# EAGLE design slot_stm32f4 (EAGLE 9.6.2)
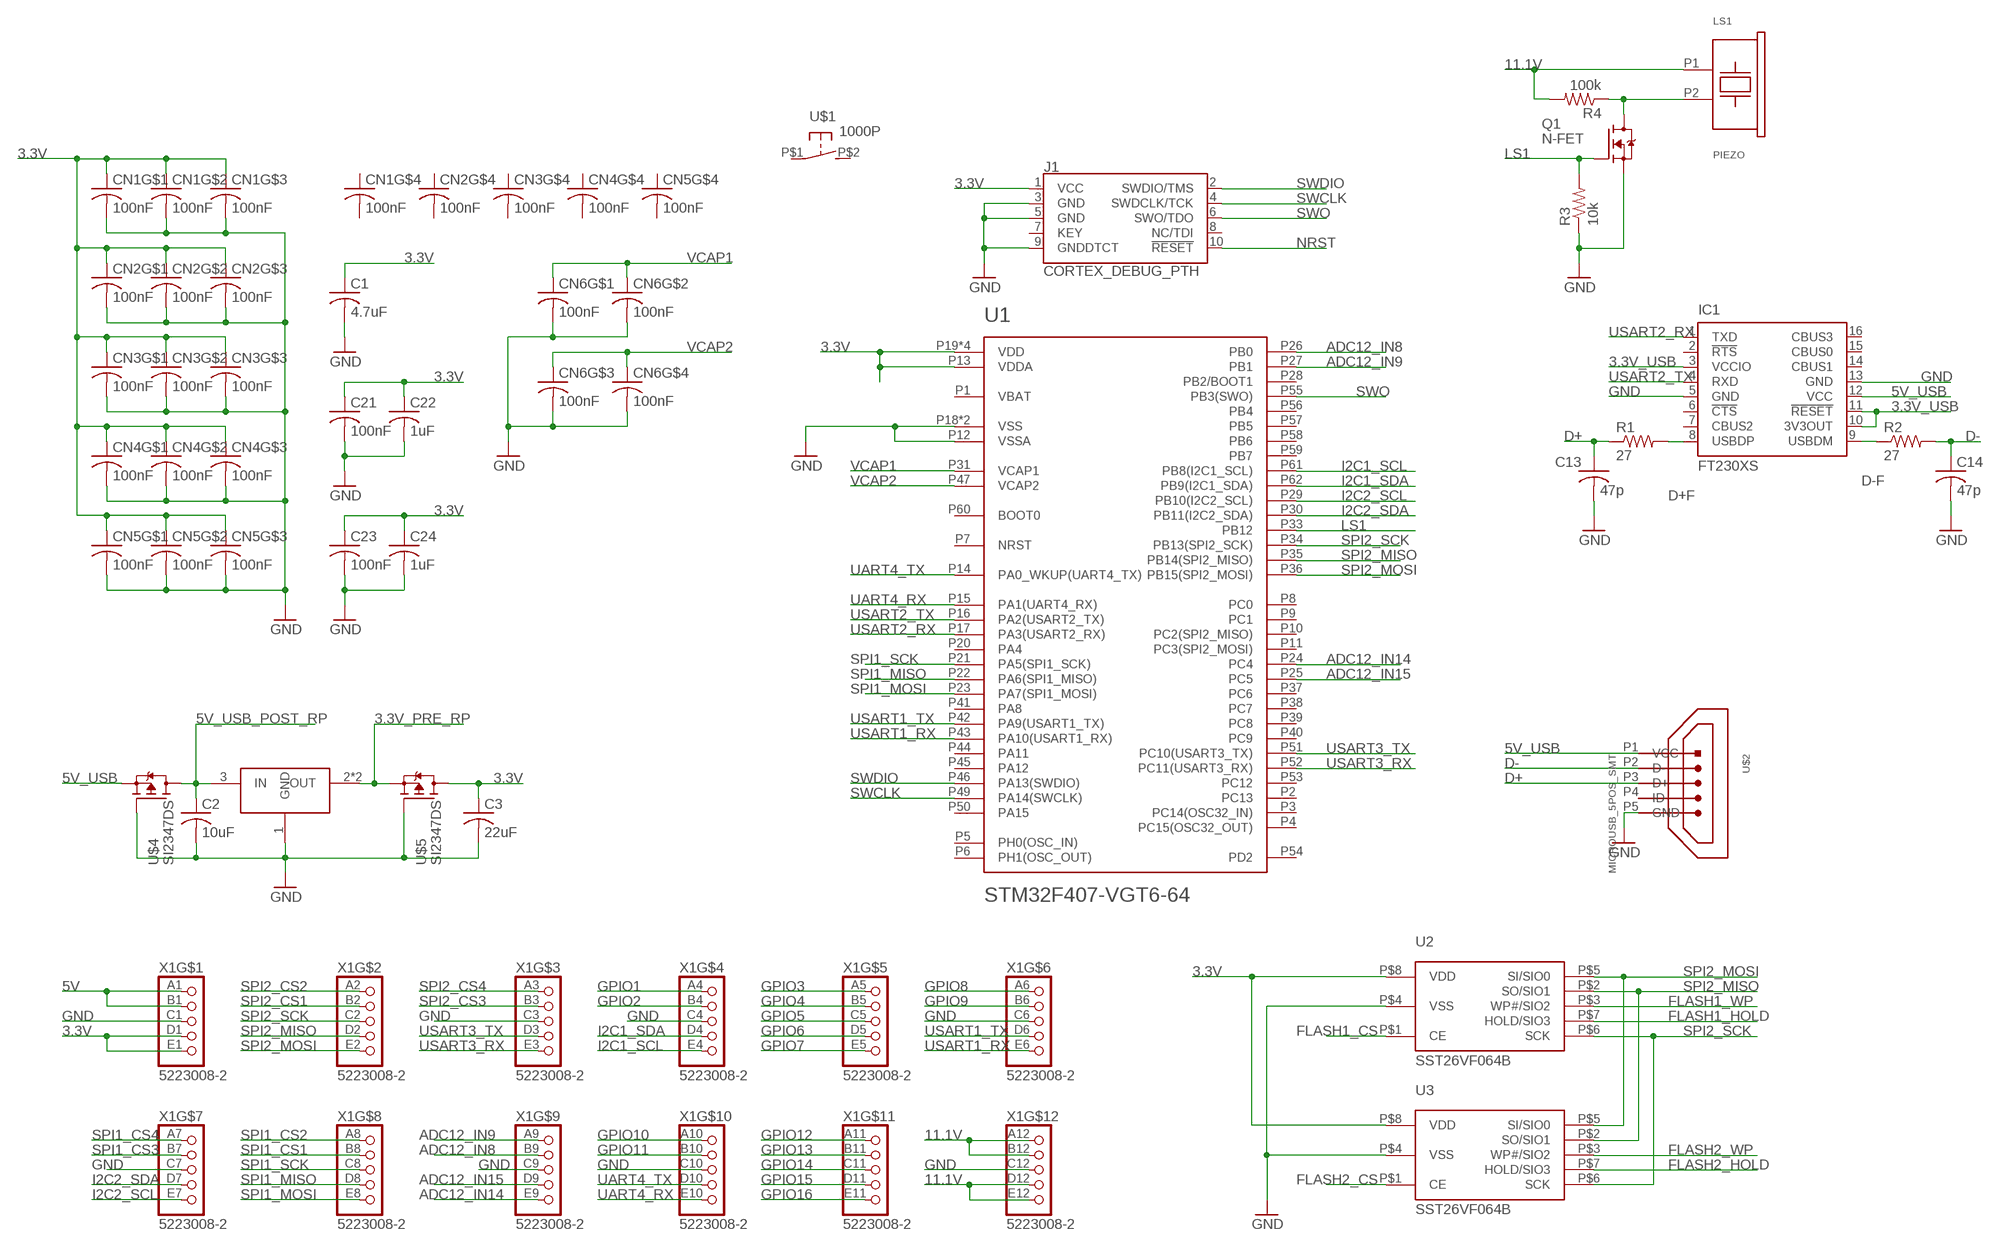
[diagram p0: schematic, sheet 1]

## Parts
C1  4.7uF  C-USC0805  [C0805]
C2  10uF  C-USC0805  [C0805]
C3  22uF  C-USC0805  [C0805]
C13  47p  C-USC0603  [C0603]
C14  47p  C-USC0603  [C0603]
C21  100nF  C-USC0805  [C0805]
C22  1uF  C-USC0805  [C0805]
C23  100nF  C-USC0805  [C0805]
C24  1uF  C-USC0805  [C0805]
CN1  100nF  CA064CXXXXXRAC  [CNET_4POS_0612]
CN2  100nF  CA064CXXXXXRAC  [CNET_4POS_0612]
CN3  100nF  CA064CXXXXXRAC  [CNET_4POS_0612]
CN4  100nF  CA064CXXXXXRAC  [CNET_4POS_0612]
CN5  100nF  CA064CXXXXXRAC  [CNET_4POS_0612]
CN6  100nF  CA064CXXXXXRAC  [CNET_4POS_0612]
IC1  FT230XS  [SSOP16]
J1  CORTEX_DEBUG_PTH  [2X5-PTH-1.27MM]
LS1  PIEZO  [PKMCS0909E400-R1]
Q1  N-FET  [NMINI3-R1-B]
R1  27  R-US_R0603  [R0603]
R2  27  R-US_R0603  [R0603]
R3  10k  R-US_R0603  [R0603]
R4  100k  R-US_R0603  [R0603]
U1  STM32F407-VGT6-64  [LQFP64]
U2  SST26VF064B  [SOIJ]
U3  SST26VF064B  [SOIJ]
U$1  1000P  [B3U-1000P]
U$2  MICROUSB_5POS_SMT  [RECPT_SMT_R/A]
U$3  AZ1117C  [SOT89]
U$4  SI2347DS  [SOT23]
U$5  SI2347DS  [SOT23]
X1  5223008-2  [5223008-2]

## Nets
3.3V: C1.1 C3.1 C21.1 C22.1 C23.1 C24.1 CN1.C1A CN1.C2A CN1.C3A CN2.C1A CN2.C2A CN2.C3A CN3.C1A CN3.C2A CN3.C3A CN4.C1A CN4.C2A CN4.C3A CN5.C1A CN5.C2A CN5.C3A J1.1(VCC) U1.P13(VDDA) U1.P19(VDD) U1.P32(VDD) U1.P48(VDD) U1.P64(VDD) U2.P$8(VDD) U3.P$8(VDD) U$5.3(D) X1.D1 X1.E1
3.3V_PRE_RP: U$3.2(OUT) U$3.2@1(OUT) U$5.2(S)
3.3V_USB: IC1.3(VCCIO) IC1.10(3V3OUT) IC1.11(!RESET)
5V: X1.A1 X1.B1
5V_USB: IC1.12(VCC) U$2.P1(VCC) U$4.2(S)
5V_USB_POST_RP: C2.1 U$3.3(IN) U$4.3(D)
11.1V: LS1.P1 R4.2 X1.A12 X1.B12 X1.D12 X1.E12
ADC12_IN8: U1.P26(PB0) X1.B9
ADC12_IN9: U1.P27(PB1) X1.A9
ADC12_IN14: U1.P24(PC4) X1.E9
ADC12_IN15: U1.P25(PC5) X1.D9
D+: C13.1 R1.1 U$2.P3(D+)
D+F: IC1.8(USBDP) R1.2
D-: C14.1 R2.2 U$2.P2(D-)
D-F: IC1.9(USBDM) R2.1
FLASH1_CS: U2.P$1(CE)
FLASH1_HOLD: U2.P$7(HOLD/SIO3)
FLASH1_WP: U2.P$3(WP#/SIO2)
FLASH2_CS: U3.P$1(CE)
FLASH2_HOLD: U3.P$7(HOLD/SIO3)
FLASH2_WP: U3.P$3(WP#/SIO2)
GND: C1.2 C2.2 C3.2 C13.2 C14.2 C21.2 C22.2 C23.2 C24.2 CN1.C1B CN1.C2B CN1.C3B CN2.C1B CN2.C2B CN2.C3B CN3.C1B CN3.C2B CN3.C3B CN4.C1B CN4.C2B CN4.C3B CN5.C1B CN5.C2B CN5.C3B CN6.C1B CN6.C2B CN6.C3B CN6.C4B IC1.5(GND) IC1.13(GND) J1.3(GND) J1.5(GND) J1.9(GNDDTCT) Q1.3(S) R3.1 U1.P12(VSSA) U1.P18(VSS) U1.P63(VSS) U2.P$4(VSS) U3.P$4(VSS) U$2.P5(GND) U$3.1(GND) U$4.1(G) U$5.1(G) X1.C1 X1.C3 X1.C4 X1.C6 X1.C7 X1.C9 X1.C10 X1.C12
GPIO1: X1.A4
GPIO2: X1.B4
GPIO3: X1.A5
GPIO4: X1.B5
GPIO5: X1.C5
GPIO6: X1.D5
GPIO7: X1.E5
GPIO8: X1.A6
GPIO9: X1.B6
GPIO10: X1.A10
GPIO11: X1.B10
GPIO12: X1.A11
GPIO13: X1.B11
GPIO14: X1.C11
GPIO15: X1.D11
GPIO16: X1.E11
I2C1_SCL: U1.P61(PB8(I2C1_SCL)) X1.E4
I2C1_SDA: U1.P62(PB9(I2C1_SDA)) X1.D4
I2C2_SCL: U1.P29(PB10(I2C2_SCL)) X1.E7
I2C2_SDA: U1.P30(PB11(I2C2_SDA)) X1.D7
LS1: Q1.2(G) R3.2 U1.P33(PB12)
N$2: LS1.P2 Q1.1(D) R4.1
NRST: J1.10(!RESET)
SPI1_CS1: X1.B8
SPI1_CS2: X1.A8
SPI1_CS3: X1.B7
SPI1_CS4: X1.A7
SPI1_MISO: U1.P22(PA6(SPI1_MISO)) X1.D8
SPI1_MOSI: U1.P23(PA7(SPI1_MOSI)) X1.E8
SPI1_SCK: U1.P21(PA5(SPI1_SCK)) X1.C8
SPI2_CS1: X1.B2
SPI2_CS2: X1.A2
SPI2_CS3: X1.B3
SPI2_CS4: X1.A3
SPI2_MISO: U1.P35(PB14(SPI2_MISO)) U2.P$2(SO/SIO1) U3.P$2(SO/SIO1) X1.D2
SPI2_MOSI: U1.P36(PB15(SPI2_MOSI)) U2.P$5(SI/SIO0) U3.P$5(SI/SIO0) X1.E2
SPI2_SCK: U1.P34(PB13(SPI2_SCK)) U2.P$6(SCK) U3.P$6(SCK) X1.C2
SWCLK: J1.4(SWDCLK/TCK) U1.P49(PA14(SWCLK))
SWDIO: J1.2(SWDIO/TMS) U1.P46(PA13(SWDIO))
SWO: J1.6(SWO/TDO) U1.P55(PB3(SWO))
UART4_RX: U1.P15(PA1(UART4_RX)) X1.E10
UART4_TX: U1.P14(PA0_WKUP(UART4_TX)) X1.D10
USART1_RX: U1.P43(PA10(USART1_RX)) X1.E6
USART1_TX: U1.P42(PA9(USART1_TX)) X1.D6
USART2_RX: IC1.1(TXD) U1.P17(PA3(USART2_RX))
USART2_TX: IC1.4(RXD) U1.P16(PA2(USART2_TX))
USART3_RX: U1.P52(PC11(USART3_RX)) X1.E3
USART3_TX: U1.P51(PC10(USART3_TX)) X1.D3
VCAP1: CN6.C1A CN6.C2A U1.P31(VCAP1)
VCAP2: CN6.C3A CN6.C4A U1.P47(VCAP2)
Unconnected: CN1.C4A CN1.C4B CN2.C4A CN2.C4B CN3.C4A CN3.C4B CN4.C4A CN4.C4B CN5.C4A CN5.C4B IC1.2(!RTS) IC1.6(!CTS) IC1.7(CBUS2) IC1.14(CBUS1) IC1.15(CBUS0) IC1.16(CBUS3) J1.7(KEY) J1.8(NC/TDI) U1.P1(VBAT) U1.P2(PC13) U1.P3(PC14(OSC32_IN)) U1.P4(PC15(OSC32_OUT)) U1.P5(PH0(OSC_IN)) U1.P6(PH1(OSC_OUT)) U1.P7(NRST) U1.P8(PC0) U1.P9(PC1) U1.P10(PC2(SPI2_MISO)) U1.P11(PC3(SPI2_MOSI)) U1.P20(PA4) U1.P28(PB2/BOOT1) U1.P37(PC6) U1.P38(PC7) U1.P39(PC8) U1.P40(PC9) U1.P41(PA8) U1.P44(PA11) U1.P45(PA12) U1.P50(PA15) U1.P53(PC12) U1.P54(PD2) U1.P56(PB4) U1.P57(PB5) U1.P58(PB6) U1.P59(PB7) U1.P60(BOOT0) U$1.P$1(P) U$1.P$2(S) U$2.P4(ID)

## Library data of the parts
C1-C3 C21-C24 = rcl:C-US: CAPACITOR, American symbol; SPICEPREFIX: C
C13 C14 = resistor:C-US: CAPACITOR, American symbol
CN1-CN6 = CPSS_MISC:CA064CXXXXXRAC
IC1 = ftdichip:FT230X: USB to BASIC UART IC Auto generated by make-symbol-device-package-bsdl.ulp Rev. 43 Source: Data sheet <http://www.ftdichip.com/Support/Documents/DataSheets/ICs/DS_FT230X.pdf>
J1 = SparkFun-Connectors:CORTEX_DEBUG: Cortex Debug Connector - 10 pin Supports JTAG debug, Serial Wire debug, and Serial Wire Viewer. PTH and SMD connector options available. General Connector Information <http://infocenter.arm.com/help/topic/com.arm.doc.faqs/attached/13634/cortex_debug_connectors.pdf> Products: PTH Connector <http://www.digikey.com/product-detail/en/cnc-tech/3220-10-0100-00/1175-1627-ND/3883661> -via Digi-Key SparkFun PSoc <https://www.sparkfun.com/products/13229> SparkFun T <https://www.sparkfun.com/products/13810>
LS1 = CPSS_MISC:PIEZO
Q1 = CPSS_MISC:N-FET
R1-R4 = resistor:R-US_: RESISTOR, American symbol
U1 = CPSS_CPU:STM32F407-VGT6-64
U2 U3 = CPSS_IC:SST26VF064B
U$1 = CPSS_MISC:1000P
U$2 = CPSS_CONNECTOR:MICROUSB_5POS_SMT
U$3 = CPSS_IC:AZ1117C
U$4 U$5 = CPSS_IC:SI2347DS
X1 = backplane:5223008-2

## Board
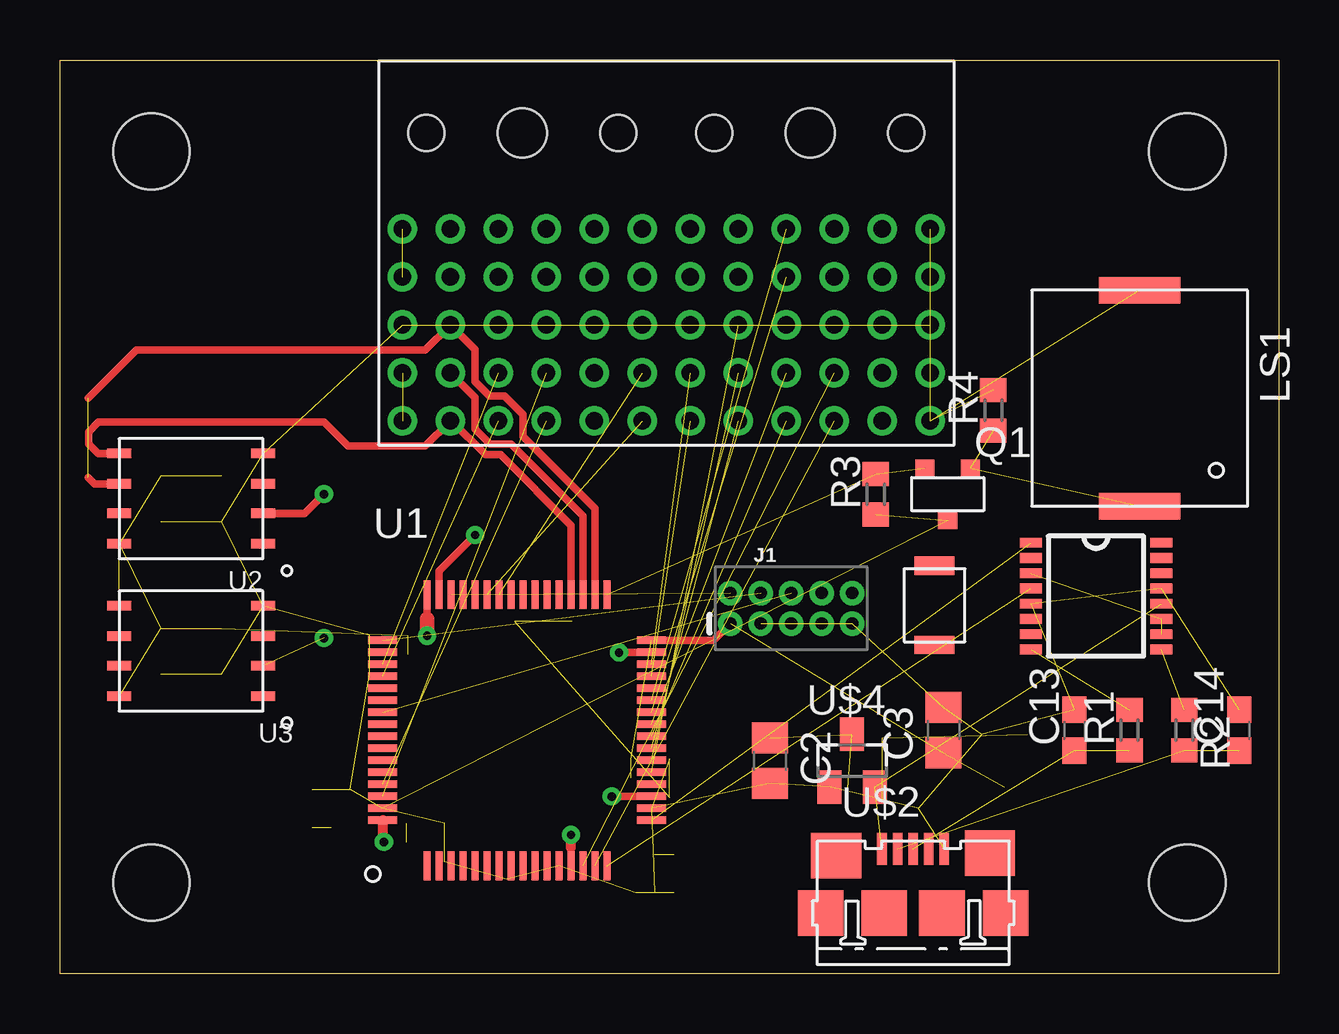
[diagram p1: board, top side]
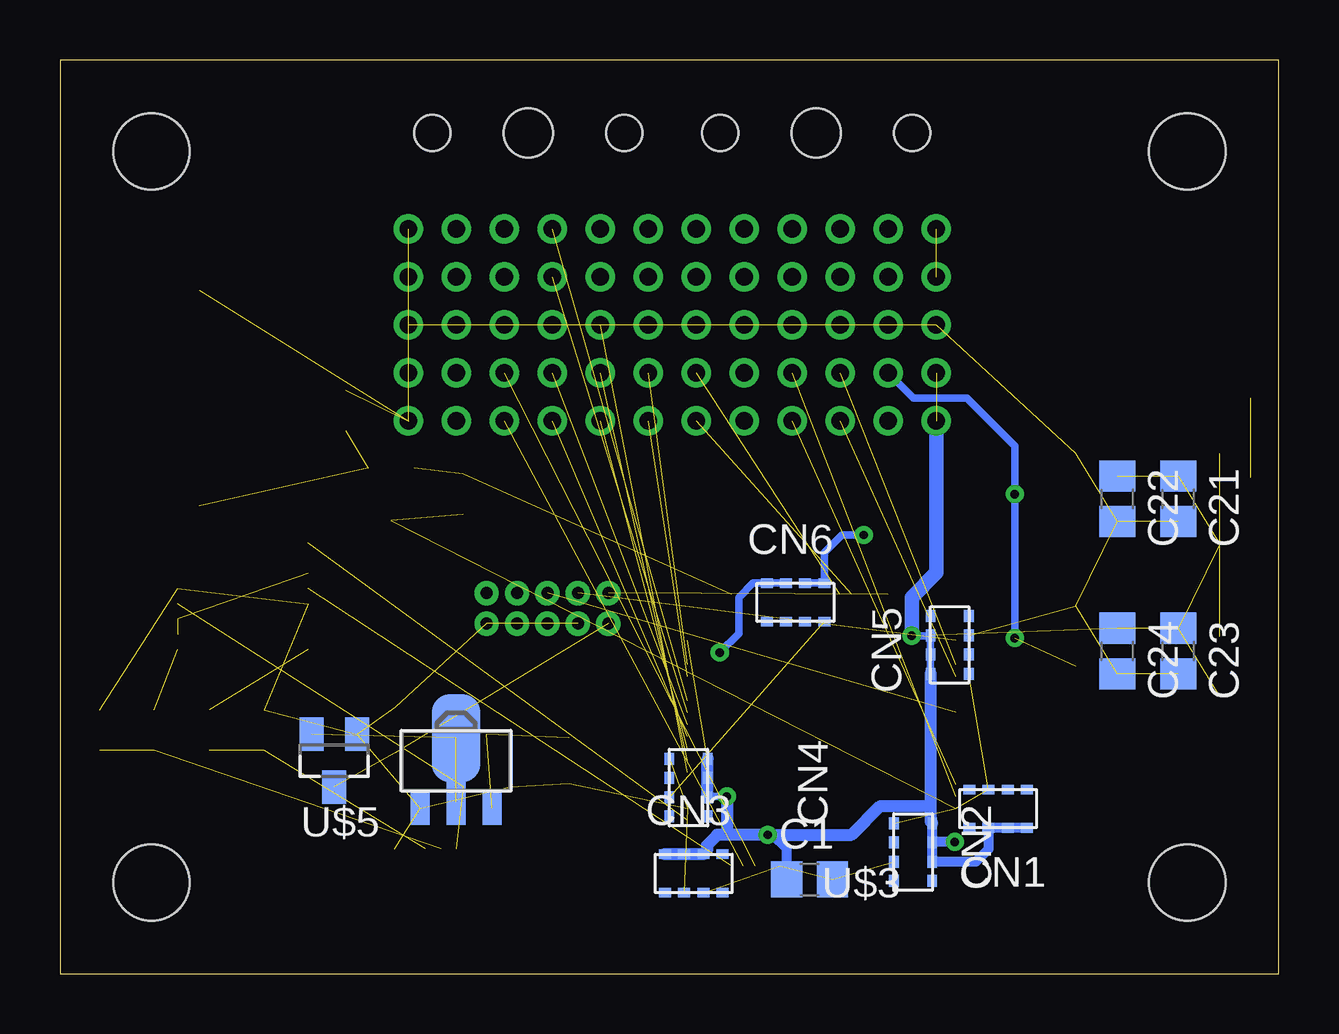
[diagram p2: board, bottom side, seen from below]

Size 50.8 x 38.1 mm. Coordinates in mm from the lower left corner, seen from the top.
Outline: 0,0 0,38.1 50.8,38.1 50.8,0 0,0
Copper layers (1*16): Top 0.035mm / dielectric 1.5mm / Bottom 0.035mm
Design rules "default": minimum track width 6mil, minimum drill 0.35mm, track to track 6mil, track to pad 6mil, pad to pad 6mil, via to via 6mil, smd to smd 6mil, copper to edge 40mil, drill to drill 6mil, minimum pad ring 10mil, minimum via ring 8mil, stop-mask expansion 4mil, vias tented up to drill 0mil, thermal gap 10mil
Holes 3.17 mm at 3.81,3.81 46.99,3.81 46.99,34.29 3.81,34.29
tRestrict: area 0,30.5 to 7.6,38.1; area 43.2,30.5 to 50.8,38.1; area 43.2,0 to 50.8,7.6; area 0,0 to 7.6,7.6

### Footprints (pad centres in the part's own frame; a part is rotated, then mirrored left to right if it is on the bottom)
C0805 = smd 1.3 x 1.5: 1 -0.95,0; 2 0.95,0
C0603 = smd 1.1 x 1: 1 -0.85,0; 2 0.85,0
CNET_4POS_0612 = smd 0.5 x 0.4: C1A -1.2,0.8; C1B -1.2,-0.8; C2A -0.4,0.8; C2B -0.4,-0.8; C3A 0.4,0.8; C3B 0.4,-0.8; C4A 1.2,0.8; C4B 1.2,-0.8
SSOP16 = smd 0.914 x 0.406: 1 -2.718,2.223; 2 -2.718,1.587; 3 -2.718,0.953; 4 -2.718,0.318; 5 -2.718,-0.318; 6 -2.718,-0.953; 7 -2.718,-1.587; 8 -2.718,-2.223; 9 2.718,-2.223; 10 2.718,-1.587; 11 2.718,-0.953; 12 2.718,-0.318; 13 2.718,0.318; 14 2.718,0.953; 15 2.718,1.587; 16 2.718,2.223
2X5-PTH-1.27MM = drill 0.508 pad 1: 1 -2.54,-0.635; 2 -2.54,0.635; 3 -1.27,-0.635; 4 -1.27,0.635; 5 0,-0.635; 6 0,0.635; 7 1.27,-0.635; 8 1.27,0.635; 9 2.54,-0.635; 10 2.54,0.635
PKMCS0909E400-R1 = smd 1.1 x 3.4: P1 -4.5,0; P2 4.5,0
NMINI3-R1-B = smd 0.8 x 0.7: 1 -0.95,-1.1; 2 0.95,-1.1; 3 0,1.1
R0603 = smd 1 x 1.1: 1 -0.85,0; 2 0.85,0
LQFP64 = smd 0.3 x 1.2: P1 -3.75,-5.65; P2 -3.25,-5.65; P3 -2.75,-5.65; P4 -2.25,-5.65; P5 -1.75,-5.65; P6 -1.25,-5.65; P7 -0.75,-5.65; P8 -0.25,-5.65; P9 0.25,-5.65; P10 0.75,-5.65; P11 1.25,-5.65; P12 1.75,-5.65; P13 2.25,-5.65; P14 2.75,-5.65; P15 3.25,-5.65; P16 3.75,-5.65; P33 3.75,5.65; P34 3.25,5.65; P35 2.75,5.65; P36 2.25,5.65; P37 1.75,5.65; P38 1.25,5.65; P39 0.75,5.65; P40 0.25,5.65; P41 -0.25,5.65; P42 -0.75,5.65; P43 -1.25,5.65; P44 -1.75,5.65; P45 -2.25,5.65; P46 -2.75,5.65; P47 -3.25,5.65; P48 -3.75,5.65 | smd 1.2 x 0.3: P17 5.6,-3.75; P18 5.6,-3.25; P19 5.6,-2.75; P20 5.6,-2.25; P21 5.6,-1.75; P22 5.6,-1.25; P23 5.6,-0.75; P24 5.6,-0.25; P25 5.6,0.25; P26 5.6,0.75; P27 5.6,1.25; P28 5.6,1.75; P29 5.6,2.25; P30 5.6,2.75; P31 5.6,3.25; P32 5.6,3.75; P49 -5.6,3.75; P50 -5.6,3.25; P51 -5.6,2.75; P52 -5.6,2.25; P53 -5.6,1.75; P54 -5.6,1.25; P55 -5.6,0.75; P56 -5.6,0.25; P57 -5.6,-0.25; P58 -5.6,-0.75; P59 -5.6,-1.25; P60 -5.6,-1.75; P61 -5.6,-2.25; P62 -5.6,-2.75; P63 -5.6,-3.25; P64 -5.6,-3.75
SOIJ = smd 1 x 0.4: P$1 -3,1.885; P$2 -3,0.614; P$3 -3,-0.614; P$4 -3,-1.885; P$5 3,-1.885; P$6 3,-0.614; P$7 3,0.614; P$8 3,1.885
B3U-1000P = smd 1.651 x 0.762: P$1 0,-1.651; P$2 0,1.651
RECPT_SMT_R/A = smd 2.1 x 1.9: ATT1 -3.2,2.4; ATT2 3.2,2.5 | smd 1.9 x 1.9: ATT3 -3.85,0; ATT4 -1.2,0; ATT5 1.2,0; ATT6 3.85,0 | smd 0.4 x 1.35: P1 -1.3,2.675; P2 -0.65,2.675; P3 0,2.675; P4 0.65,2.675; P5 1.3,2.675
SOT89 = smd 0.8 x 1.4: 1 -1.499,-1.981; 3 1.499,-1.981 | smd 0.8 x 1.9: 2 0,-1.727 | smd 2.032 x 3.65: 2@1 0,0.94
SOT23 = smd 1 x 1.4: 1 -0.95,-1.1; 2 0.95,-1.1; 3 0,1.1
5223008-2 = drill 0.725: A1 -11,4; A2 -9,4; A3 -7,4; A4 -5,4; A5 -3,4; A6 -1,4; A7 1,4; A8 3,4; A9 5,4; A10 7,4; A11 9,4; A12 11,4; B1 -11,2; B2 -9,2; B3 -7,2; B4 -5,2; B5 -3,2; B6 -1,2; B7 1,2; B8 3,2; B9 5,2; B10 7,2; B11 9,2; B12 11,2; C1 -11,0; C2 -9,0; C3 -7,0; C4 -5,0; C5 -3,0; C6 -1,0; C7 1,0; C8 3,0; C9 5,0; C10 7,0; C11 9,0; C12 11,0; D1 -11,-2; D2 -9,-2; D3 -7,-2; D4 -5,-2; D5 -3,-2; D6 -1,-2; D7 1,-2; D8 3,-2; D9 5,-2; D10 7,-2; D11 9,-2; D12 11,-2; E1 -11,-4; E2 -9,-4; E3 -7,-4; E4 -5,-4; E5 -3,-4; E6 -1,-4; E7 1,-4; E8 3,-4; E9 5,-4; E10 7,-4; E11 9,-4; E12 11,-4 | hole 2.05: -6,8; 6,8 | hole 1.5: -10,8; -2,8; 10,8; 2,8

### Placement (x,y rotation side)
C1  19.56,3.94 0 bottom
C2  29.59,8.89 270 top
C3  36.83,10.16 90 top
C13  42.29,10.16 90 top
C14  49.15,10.16 90 top
C21  4.19,19.81 270 bottom
C22  6.73,19.81 270 bottom
C23  4.19,13.46 270 bottom
C24  6.73,13.46 270 bottom
CN1  11.7,6.89 180 bottom
CN2  15.24,5.08 270 bottom
CN3  24.38,4.19 0 bottom
CN4  24.6,7.77 270 bottom
CN5  13.72,13.72 90 bottom
CN6  20.14,15.49 0 bottom
IC1  43.18,15.75 0 top
J1  30.48,15.24 0 top
LS1  45,24 270 top
Q1  37,20 180 top
R1  44.58,10.16 90 top
R2  46.86,10.16 270 top
R3  34,20 90 top
R4  38.9,23.5 90 top
U1  19.05,10.16 0 top
U2  5.46,19.81 180 top
U3  5.46,13.46 180 top
U$1  36.45,15.37 0 top
U$2  35.56,2.54 0 top
U$3  34.29,8.89 0 bottom
U$4  33.02,8.89 0 top
U$5  39.37,8.89 180 bottom
X1  25.27,27.05 0 top

### Tracks (layer width: path | path; a pad name or v marks a point on that pad's centre or on a via)
3.3V  (via drill 0.35)  (15 unrouted)
  Top 0.305: U1.P13 21.3,5.26 | 15.3,14.8 U1.P48 | U1.P19 v23.01,7.41 v23,7.4 | U1.P32 27.25,13.91 J1.1
  Top 0.406: U1.P64 13.45,5.55 v13.5,5.5 | 21.3,5.26 v21.3,5.8
  Top 0.61: v15.3,14.1 15.3,14.8
  Bottom 0.305: CN5.C1A CN5.C3A 14.53,14.1 v15.3,14.1 | v23,7.4 23.77,7.4 CN4.C3A
  Bottom 0.406: CN1.C1A CN1.C3A 12.1,5.2 12.62,4.68 CN2.C3A 14.44,5.5 | 14.44,5.5 CN2.C1A | v13.5,5.5 14.44,5.5 | C1.1 20.51,5.21 21.1,5.8 v21.3,5.8
  Bottom 0.508: CN5.C1A 14.52,7 | 14.52,7 14.52,6.36 CN2.C1A | 14.52,7 16.6,7 17.8,5.8 v21.3,5.8 23,5.8 | 23,5.8 23.4,5.8 23.84,5.36 23.84,5.13 CN3.C3A CN3.C1A | CN4.C3A CN4.C1A | v23,7.4 23,5.8
  Bottom 0.61: X1.E1 14.27,16.73 15.3,15.7 v15.3,14.1
3.3V_PRE_RP  (2 unrouted)
3.3V_USB  (2 unrouted)
5V  (1 unrouted)
5V_USB  (2 unrouted)
5V_USB_POST_RP  (2 unrouted)
11.1V  (5 unrouted)
ADC12_IN8  (1 unrouted)
ADC12_IN9  (1 unrouted)
ADC12_IN14  (1 unrouted)
ADC12_IN15  (1 unrouted)
D+  (2 unrouted)
D+F  (1 unrouted)
D-  (2 unrouted)
D-F  (1 unrouted)
GND  (51 unrouted)
I2C1_SCL  (1 unrouted)
I2C1_SDA  (1 unrouted)
I2C2_SCL  (1 unrouted)
I2C2_SDA  (1 unrouted)
LS1  (2 unrouted)
N$2  (2 unrouted)
SPI1_MISO  (1 unrouted)
SPI1_MOSI  (1 unrouted)
SPI1_SCK  (1 unrouted)
SPI2_MISO  (via drill 0.35)  (1 unrouted)
  Top 0.305: X1.D2 17.3,24.02 17.3,22.72 17.92,22.1 18.8,22.1 21.8,19.1 U1.P35 | U2.P$2 10.2,19.2 v11,20
  Bottom 0.305: X1.D2 15.22,24 13,24 11,22 v11,20 v11,14
SPI2_MOSI  (1 unrouted)
  Top 0.305: U1.P36 21.3,18.7 18.36,21.64 17.73,21.64 16.32,23.05 X1.E2 15.22,22 12,22 11,23 1.6,23 1.2,22.6 1.2,22.1 1.6,21.7 U2.P$5
SPI2_SCK  (2 unrouted)
  Top 0.305: U1.P34 22.3,19.4 19.3,22.4 19.3,23.33 18.53,24.1 17.9,24.1 17.3,24.7 17.3,26.02 X1.C2 15.22,26 3.17,26 1.17,24 | U2.P$6 1.44,20.43 1.17,20.7
SWCLK  (1 unrouted)
SWDIO  (1 unrouted)
SWO  (1 unrouted)
UART4_RX  (1 unrouted)
UART4_TX  (1 unrouted)
USART1_RX  (1 unrouted)
USART1_TX  (1 unrouted)
USART2_RX  (1 unrouted)
USART2_TX  (1 unrouted)
USART3_RX  (1 unrouted)
USART3_TX  (1 unrouted)
VCAP1  (via drill 0.35)
  Top 0.305: v23.3,13.4 U1.P31
  Bottom 0.305: CN6.C2A CN6.C1A 21.91,16.29 22.5,15.7 22.5,14.2 v23.3,13.4
VCAP2  (via drill 0.35)
  Top 0.305: U1.P47 15.8,16.8 v17.3,18.3
  Bottom 0.305: v17.3,18.3 18.2,18.3 18.94,17.56 CN6.C4A CN6.C3A